# Altium schematic sheet gps_module.SchDoc
size A4
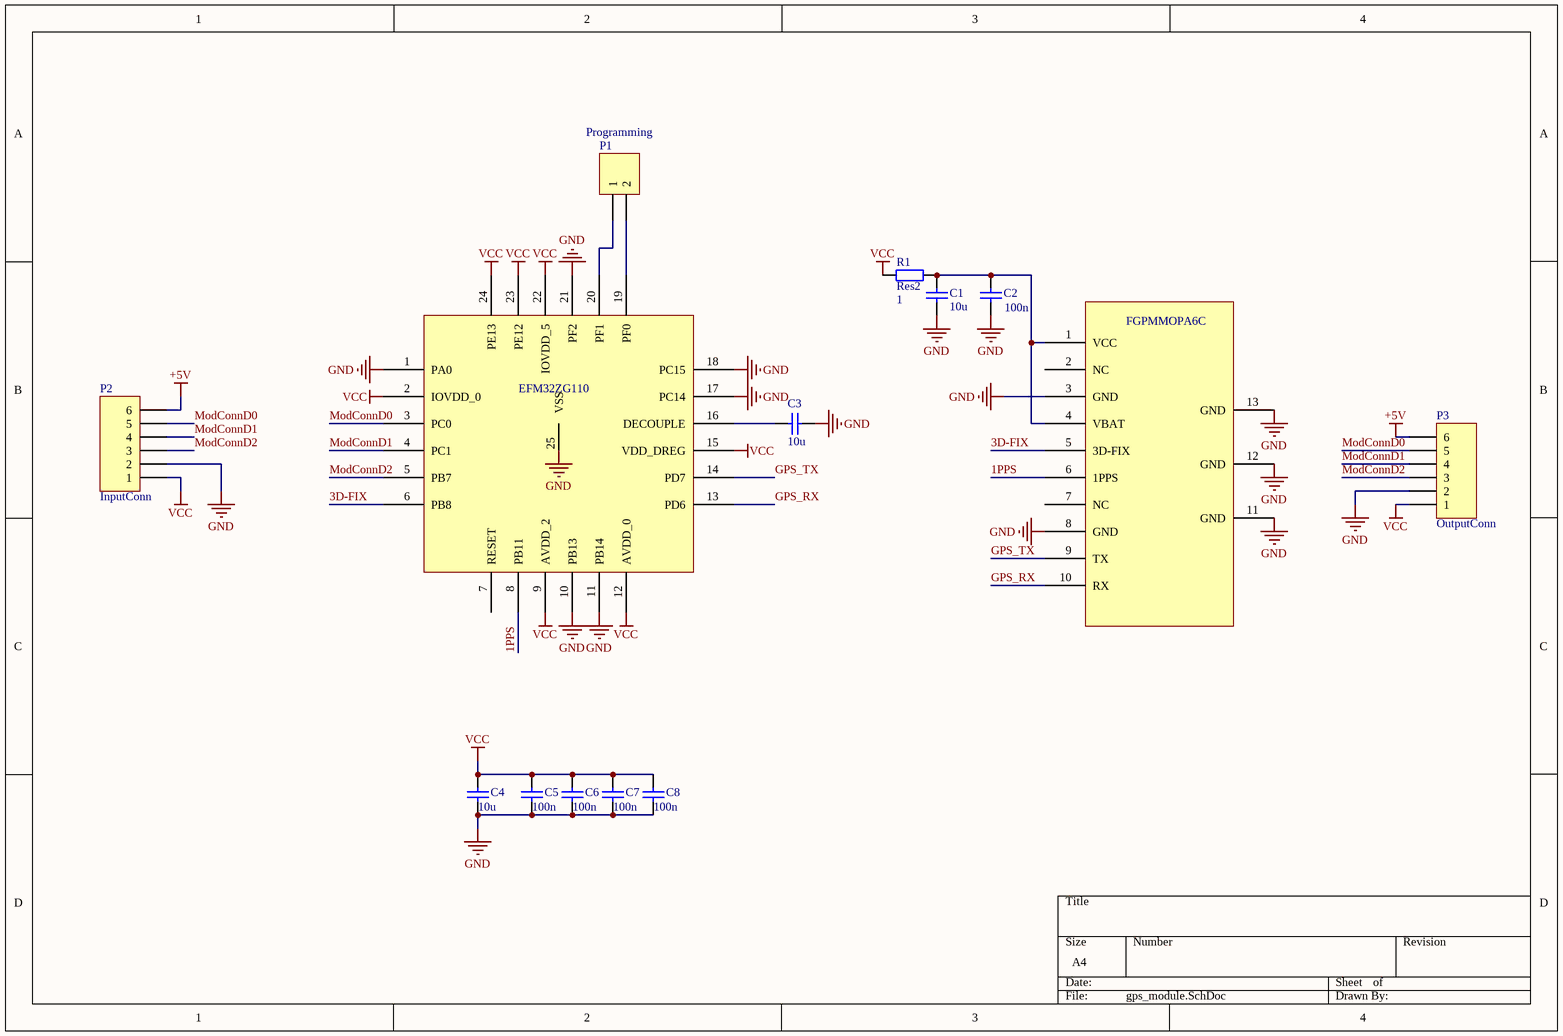
[diagram p0: gps_module.SchDoc]

## Parts
C1  10u  [0805]
C2  value 100n  [1608[0603]]  (hidden comment: Cap Semi)
C3  10u  [0805]
C4  10u  [0805]
C5  value 100n  [1608[0603]]  (hidden comment: Cap Semi)
C6  value 100n  [1608[0603]]  (hidden comment: Cap Semi)
C7  value 100n  [1608[0603]]  (hidden comment: Cap Semi)
C8  value 100n  [1608[0603]]  (hidden comment: Cap Semi)
P1  Programming  [GeckoProgramming]
P2  InputConn  [Goldpin6_1.27mm]
P3  OutputConn  [Goldpin6_1.27mm]
R1  Res2  value 1  [0805]
U1  EFM32ZG110  [QFN24_5x5_0.65]
U2  FGPMMOPA6C  [FGPMMOPA6C]

## Nets
+5V: P2.6 P3.6
GND: C1.2 C2.1 C3.1 C4.1 C5.1 C6.1 C7.1 C8.1 P2.2 P3.2 U1.1(PA0) U1.10(PB13) U1.11(PB14) U1.17(PC14) U1.18(PC15) U1.21(PF2) U1.25(VSS) U2.3(GND) U2.8(GND) U2.11(GND) U2.12(GND) U2.13(GND)
VCC: C4.2 C5.2 C6.2 C7.2 C8.2 P2.1 P3.1 R1.1 U1.2(IOVDD_0) U1.9(AVDD_2) U1.12(AVDD_0) U1.15(VDD_DREG) U1.22(IOVDD_5) U1.23(PE12) U1.24(PE13)
1PPS: U1.8(PB11) U2.6(1PPS)
3D-FIX: U1.6(PB8) U2.5(3D-FIX)
GPS_RX: U1.13(PD6) U2.10(RX)
GPS_TX: U1.14(PD7) U2.9(TX)
ModConnD0: P2.5 P3.5 U1.3(PC0)
ModConnD1: P2.4 P3.4 U1.4(PC1)
ModConnD2: P2.3 P3.3 U1.5(PB7)
NetC1_1: C1.1 C2.2 R1.2 U2.1(VCC) U2.4(VBAT)
NetC3_2: C3.2 U1.16(DECOUPLE)
NetP1_1: P1.1 U1.20(PF1)
NetP1_2: P1.2 U1.19(PF0)

Not connected (* = marked no-connect by the designer): U1 7(RESET); U2 2(NC) 7(NC)

## Library data of the parts
C1-C8 = Cap Semi: Capacitor (Semiconductor SIM Model); Published: 8-Jun-2000; LatestRevisionDate: 29-May-2009; LatestRevisionNote: IPC-7351 Footprint Added.; PackageReference: C1206; Publisher: Altium Limited; PackageDescription: Chip Capacitor
  C1 C3 C4: Value: 10u
P1 = MHDR1X2: Header, 2-Pin; LatestRevisionDate: 17-Jul-2002; LatestRevisionNote: Re-released for DXP Platform.; Publisher: Altium Limited
P2 P3 = MHDR1X6: Header, 6-Pin; LatestRevisionDate: 17-Jul-2002; LatestRevisionNote: Re-released for DXP Platform.; Publisher: Altium Limited
R1 = Res2: Resistor; Published: 8-Jun-2000; LatestRevisionDate: 17-Jul-2002; LatestRevisionNote: Re-released for DXP Platform.; PackageReference: AXIAL-0.4; Publisher: Altium Limited; PackageDescription: Axial Device, Thru-Hole; 2 Leads; 0.4 in Pin Spacing